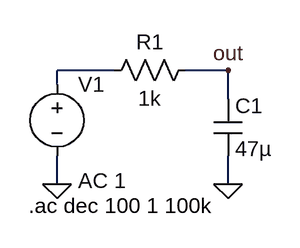
[diagram p0: schematic lowpassRC.asc]
lowpassRC.asc, the LTspice schematic file:
Version 4
SHEET 1 880 680
WIRE 48 96 -16 96
WIRE 176 96 128 96
WIRE -16 112 -16 96
WIRE 176 128 176 96
WIRE -16 224 -16 192
WIRE 176 224 176 192
FLAG 176 224 0
FLAG -16 224 0
FLAG 176 96 out
SYMBOL res 144 80 R90
WINDOW 0 0 56 VBottom 2
WINDOW 3 32 56 VTop 2
SYMATTR InstName R1
SYMATTR Value 1k
SYMBOL cap 160 128 R0
SYMATTR InstName C1
SYMATTR Value 47µ
SYMBOL voltage -16 96 R0
WINDOW 123 24 124 Left 2
WINDOW 39 0 0 Left 2
SYMATTR Value2 AC 1
SYMATTR InstName V1
SYMATTR Value ""
TEXT -48 248 Left 2 !.ac dec 100 1 100k

The netlist it stands for:
* lowpassRC.asc
R1 out N001 1k
C1 out 0 47µ
V1 N001 0 AC 1
.ac dec 100 1 100k
.backanno
.end

* Results of the author's LTspice run, read from the files saved beside the schematic
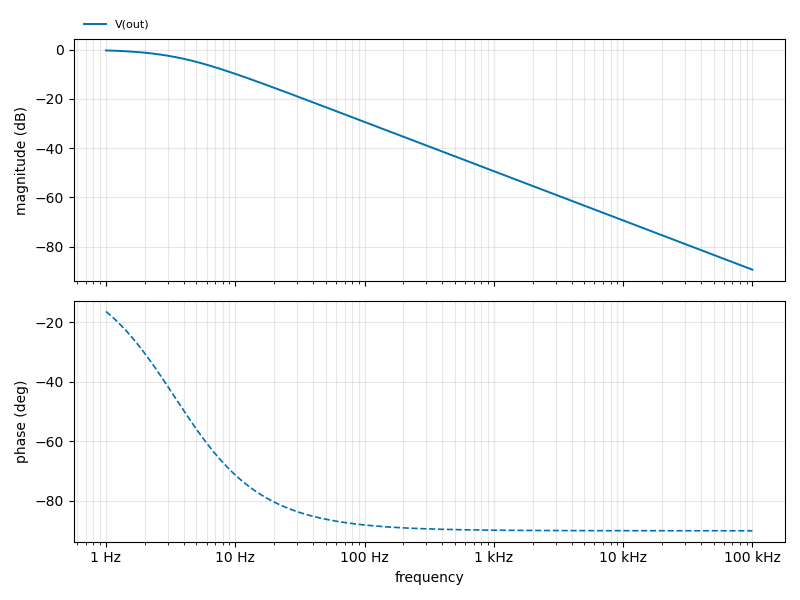
[diagram p1: AC Analysis of lowpassRC.asc, plotted from the saved traces]
* AC Analysis, 1 run:
*   V(out): -0.36 dB at 1 Hz, -89.41 dB at 100 kHz, peak -0.36 dB at 1 Hz, 3 dB below the peak at 3.669 Hz